# Altium schematic sheet MOSFETs.SchDoc
size A; SheetNumber: 5; SheetTotal: 8
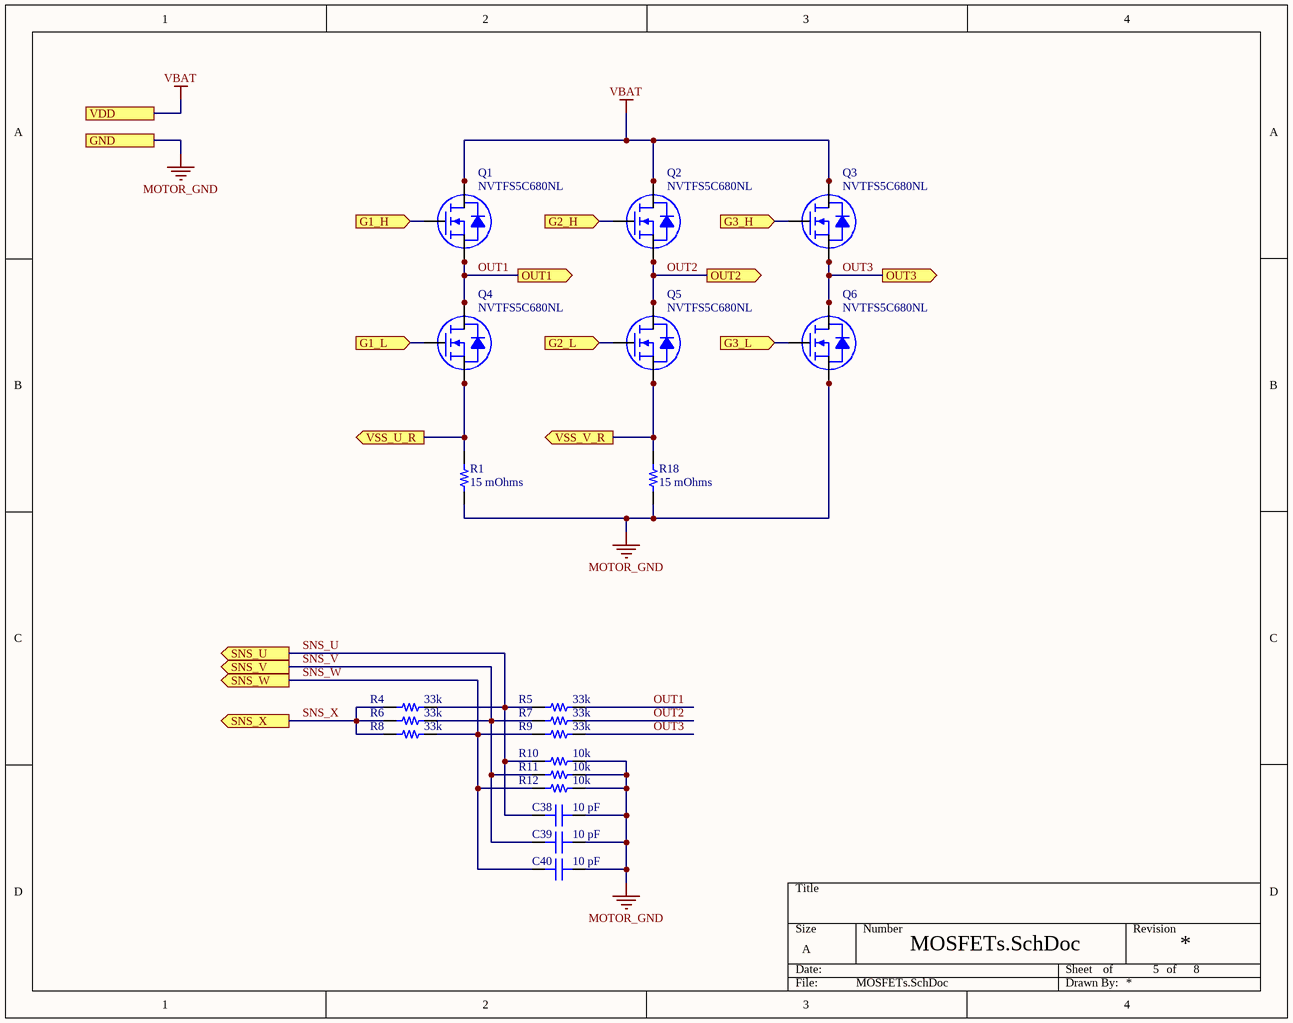
[diagram p0: MOSFETs.SchDoc]

## Parts
C38  10 pF  [CAP 0201_0603]
C39  10 pF  [CAP 0201_0603]
C40  10 pF  [CAP 0201_0603]
Q1  NVTFS5C680NL  [NVTFS015N04CTAG]
Q2  NVTFS5C680NL  [NVTFS015N04CTAG]
Q3  NVTFS5C680NL  [NVTFS015N04CTAG]
Q4  NVTFS5C680NL  [NVTFS015N04CTAG]
Q5  NVTFS5C680NL  [NVTFS015N04CTAG]
Q6  NVTFS5C680NL  [NVTFS015N04CTAG]
R1  15 mOhms  [RES 0805_2012]
R4  33k  [RES 0201_0603]
R5  33k  [RES 0201_0603]
R6  33k  [RES 0201_0603]
R7  33k  [RES 0201_0603]
R8  33k  [RES 0201_0603]
R9  33k  [RES 0201_0603]
R10  10k  [RES 0201_0603]
R11  10k  [RES 0201_0603]
R12  10k  [RES 0201_0603]
R18  15 mOhms  [RES 0805_2012]

## Ports
G1_H (in), G1_L (in), G2_H (in), G2_L (in), G3_H (in), G3_L (in), GND, OUT1 (out), OUT2 (out), OUT3 (out), SNS_U (out), SNS_V (out), SNS_W (out), SNS_X (out), VDD, VSS_U_R (out), VSS_V_R (out)

## Nets
MOTOR_GND: C38.2 C39.2 C40.2 Q6.1(S) Q6.2(S) Q6.3(S) R1.1 R10.2 R11.2 R12.2 R18.1 ; port GND
VBAT: Q1.5(D) Q1.6(D) Q1.7(D) Q1.8(D) Q2.5(D) Q2.6(D) Q2.7(D) Q2.8(D) Q3.5(D) Q3.6(D) Q3.7(D) Q3.8(D) ; port VDD
G1_H: Q1.4(G) ; port G1_H
G1_L: Q4.4(G) ; port G1_L
G2_H: Q2.4(G) ; port G2_H
G2_L: Q5.4(G) ; port G2_L
G3_H: Q3.4(G) ; port G3_H
G3_L: Q6.4(G) ; port G3_L
OUT1: Q1.1(S) Q1.2(S) Q1.3(S) Q4.5(D) Q4.6(D) Q4.7(D) Q4.8(D) R5.2 ; port OUT1
OUT2: Q2.1(S) Q2.2(S) Q2.3(S) Q5.5(D) Q5.6(D) Q5.7(D) Q5.8(D) R7.2 ; port OUT2
OUT3: Q3.1(S) Q3.2(S) Q3.3(S) Q6.5(D) Q6.6(D) Q6.7(D) Q6.8(D) R9.2 ; port OUT3
SNS_U: C38.1 R4.2 R5.1 R10.1 ; port SNS_U
SNS_V: C39.1 R6.2 R7.1 R11.1 ; port SNS_V
SNS_W: C40.1 R8.2 R9.1 R12.1 ; port SNS_W
SNS_X: R4.1 R6.1 R8.1 ; port SNS_X
VSS_U_R: Q4.1(S) Q4.2(S) Q4.3(S) R1.2 ; port VSS_U_R
VSS_V_R: Q5.1(S) Q5.2(S) Q5.3(S) R18.2 ; port VSS_V_R

## Notes on the sheet
- of

## Library data of the parts
C38-C40 = GRT033R6YA104KE01D: CAP CER 0.1UF 35V X5R 0201; manufacturer: Murata Electronics; Capacitance: 0.1 µF; Tolerance: ±10%; Part Number: GRT033R6YA104KE01D; Value: 10 pF; Applications: Automotive; componentlink1description: Datasheet; componentlink1url: https://search.murata.co.jp/Ceramy/image/img/A01X/G101/ENG/GRT033R6YA104KE01-01.pdf; componentlink2description: DigiKey Link; componentlink2url: https://www.digikey.com/en/products/detail/murata-electronics/GRT033R6YA104KE01D/10694796; Device Package: 0201 (0603 Metric); lastupdated: 7/15/2023 7:00:43 PM; Lifecycle Status: Active; Minimum Order: 1; Mounting Type: Surface Mount, MLCC; Operating Temperature: -55°C ~ 85°C; Package / Case: 0201 (0603 Metric); packaging: TapeAndReel; partid: 49925; Part Status: Active; price: 0.01; Ratings: AEC-Q200; series: GRT; Size / Dimension: 0.024" L x 0.012" W (0.60mm x 0.30mm); Supplier 1: DigiKey; Supplier Part Number 1: 490-GRT033R6YA104KE01DCT-ND; Temperature Coefficient: X5R; Thickness (Max): 0.013" (0.33mm); Voltage - Rated: 35V
Q1-Q6 = NVTFS5C680NL: N-FET
R1 R18 = PCAN0805E2002BST5: RES SMD 20K OHM 0.1% 1W 0805; Manufacturer: Vishay Thin Film; Resistance: 20 kOhms; Temperature Coefficient: ±25ppm/°C; Part Number: PCAN0805E2002BST5; Value: 15 mOhms; ComponentLink1Description: Datasheet; ComponentLink1URL: http://www.vishay.com/docs/60125/pcan.pdf; ComponentLink2Description: DigiKey Link; ComponentLink2URL: http://digikey.com/product-detail/en/vishay-thin-film/PCAN0805E2002BST5/764-1242-1-ND/6003316; Composition: Thin Film; Device Package: 0805 (2012 Metric); Features: Flame Proof, Moisture Resistant, Safety; Height - Seated (Max): 0.018" (0.46mm); LastUpdated: 8/26/2022 12:02:22 PM; Lifecycle Status: Active; Minimum Order: 1; Number of Terminations: 2; Operating Temperature: -55°C ~ 155°C; Package / Case: 0805 (2012 Metric); Packaging: TapeAndReel; PartId: 32096; Part Status: Active; Power (Watts): 1W; Price: 0.59; Series: PCAN; Size / Dimension: 0.080" L x 0.050" W (2.03mm x 1.27mm); Supplier 1: DigiKey; Supplier Part Number 1: 764-1242-1-ND; Supplier Device Package: 0805; Tolerance: ±0.1%
R4-R12 = CRCW020110K0FKED: RES SMD 10K OHM 1% 1/20W 0201; Manufacturer: Vishay Dale; Power (Watts): 0.05W, 1/20W; Resistance: 10 kOhms; Temperature Coefficient: ±100ppm/°C; Part Number: CRCW020110K0FKED; ComponentLink1Description: Datasheet; ComponentLink1URL: http://www.vishay.com/docs/20052/crcw0201e3.pdf; ComponentLink2Description: DigiKey Link; ComponentLink2URL: https://www.digikey.com/en/products/detail/vishay-dale/CRCW020110K0FKED/1967989; Composition: Thick Film; Device Package: 0201 (0603 Metric); Height - Seated (Max): 0.010" (0.26mm); LastUpdated: 7/12/2023 7:17:23 PM; Lifecycle Status: Active; Minimum Order: 1; Number of Terminations: 2; Operating Temperature: -55°C ~ 155°C; Package / Case: 0201 (0603 Metric); Packaging: TapeAndReel; PartId: 29; Part Status: Active; Price: 0.02; Series: CRCW; Size / Dimension: 0.024" L x 0.012" W (0.60mm x 0.30mm); Supplier 1: DigiKey; Supplier Part Number 1: 541-10.0KAABCT-ND; Supplier Device Package: 0201; Tolerance: ±1%
  R4-R9: Value: 33k
  R10-R12: Value: 10k